# EAGLE design Adafruit 2.13in Tri-Color eInk FeatherWing (EAGLE 9.2.0)
COMPANY: ADAFRUIT INDUSTRIES; DRAWN: K. TOWNSEND; REV: A
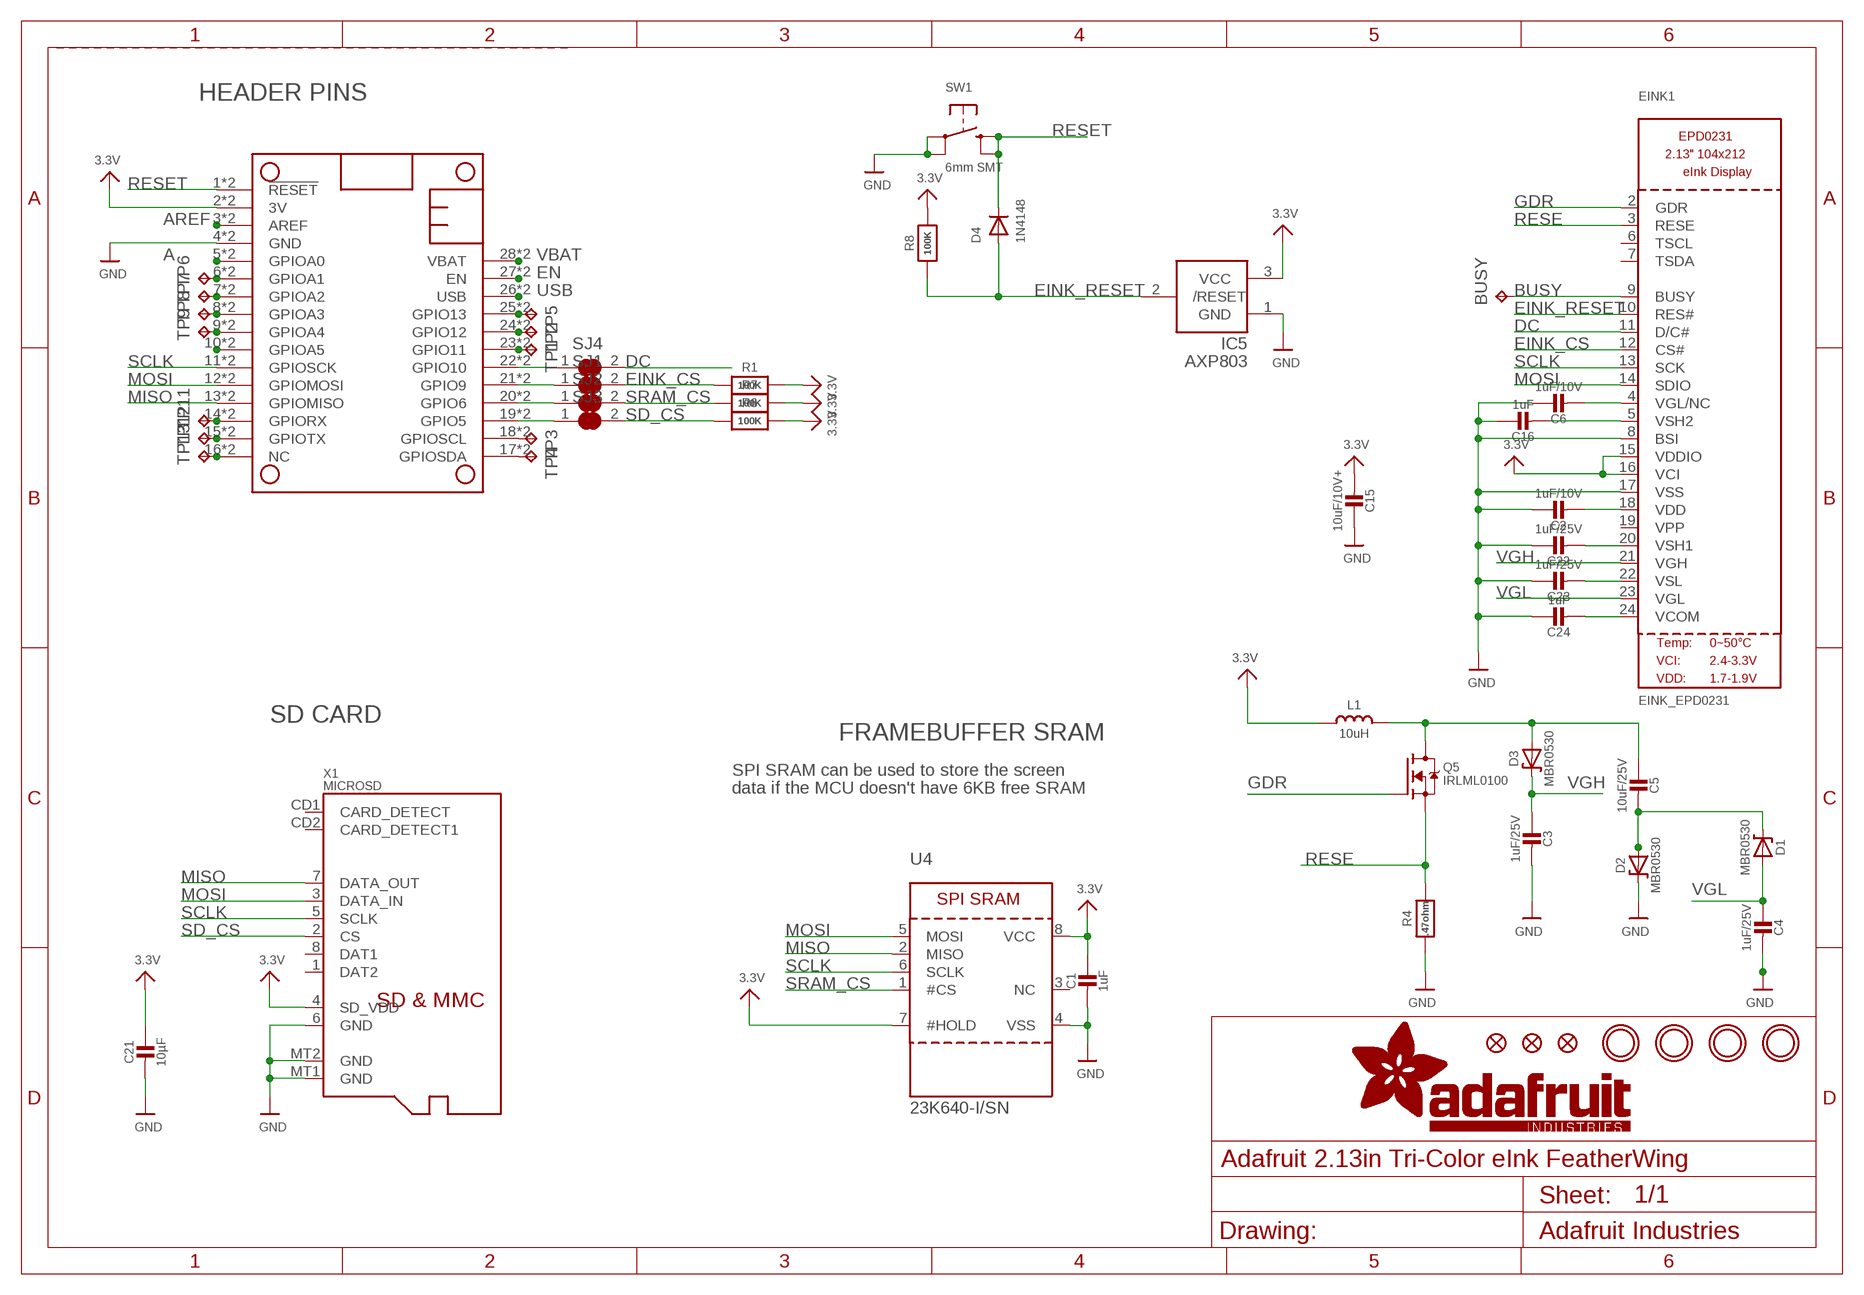
[diagram p0: schematic, sheet 1]

## Parts
BUSY  TPTP15SQ  [TP15SQ]
C1  1uF  CAP_CERAMIC0805_10MGAP  [0805_10MGAP]
C2  1uF/10V  CAP_CERAMIC0805-NOOUTLINE  [0805-NO]
C3  1uF/25V  CAP_CERAMIC0805-NOOUTLINE  [0805-NO]
C4  1uF/25V  CAP_CERAMIC0805-NOOUTLINE  [0805-NO]
C5  10uF/25V  CAP_CERAMIC0805-NOOUTLINE  [0805-NO]
C6  1uF/10V  CAP_CERAMIC0805-NOOUTLINE  [0805-NO]
C15  10uF/10V+  CAP_CERAMIC0805-NOOUTLINE  [0805-NO]
C16  1uF  CAP_CERAMIC0805-NOOUTLINE  [0805-NO]
C21  10µF  CAP_CERAMIC0805-NOOUTLINE  [0805-NO]
C22  1uF/25V  CAP_CERAMIC0805-NOOUTLINE  [0805-NO]
C23  1uF/25V  CAP_CERAMIC0805-NOOUTLINE  [0805-NO]
C24  1uF  CAP_CERAMIC0805-NOOUTLINE  [0805-NO]
D1  MBR0530  DIODE-SCHOTTKYSOD-123  [SOD-123]
D2  MBR0530  DIODE-SCHOTTKYSOD-123  [SOD-123]
D3  MBR0530  DIODE-SCHOTTKYSOD-123  [SOD-123]
D4  1N4148  DIODESOD-323F  [SOD-323F]
EINK1  EINK_EPD0231  [EINK_213IN_104X212]
FID1  FIDUCIAL_1MM  [FIDUCIAL_1MM]
FID2  FIDUCIAL_1MM  [FIDUCIAL_1MM]
FID3  FIDUCIAL_1MM  [FIDUCIAL_1MM]
IC5  AXP803  AXP083-SAG  [SOT23]
L1  10uH  INDUCTORNR401  [INDUCTOR_4X4MM_NR401]
MS1  FEATHERWING_SMTDUALNOHOLES  [FEATHERWING_SMT_NOHOLES]
Q5  IRLML0100  IRLML2060TRPBF  [SOT23-3]
R1  100K  RESISTOR_0603_NOOUT  [0603-NO]
R4  .47ohm  RESISTOR0805_10MGAP  [0805_10MGAP]
R6  100K  RESISTOR_0603_NOOUT  [0603-NO]
R7  100K  RESISTOR_0603_NOOUT  [0603-NO]
R8  100K  RESISTOR_0603_NOOUT  [0603-NO]
SJ1  SOLDERJUMPER_CLOSED  [SOLDERJUMPER_CLOSEDWIRE]
SJ2  SOLDERJUMPER_CLOSED  [SOLDERJUMPER_CLOSEDWIRE]
SJ3  SOLDERJUMPER_CLOSED  [SOLDERJUMPER_CLOSEDWIRE]
SJ4  SOLDERJUMPER_CLOSED  [SOLDERJUMPER_CLOSEDWIRE]
SW1  6mm SMT  SWITCH_TACT_SMT_EVQQ2_SMALL  [EVQ-Q2_SMALLER]
TP1  TPTP15SQ  [TP15SQ]
TP2  TPTP15SQ  [TP15SQ]
TP3  TPTP15SQ  [TP15SQ]
TP4  TPTP15SQ  [TP15SQ]
TP5  TPTP15SQ  [TP15SQ]
TP6  TPTP15SQ  [TP15SQ]
TP7  TPTP15SQ  [TP15SQ]
TP8  TPTP15SQ  [TP15SQ]
TP9  TPTP15SQ  [TP15SQ]
TP11  TPTP15SQ  [TP15SQ]
TP12  TPTP15SQ  [TP15SQ]
TP13  TPTP15SQ  [TP15SQ]
U4  23K640-I/SN  SRAM_SPI_SOIC8  [SOIC8_150MIL]
U$3  MOUNTINGHOLE2.5  [MOUNTINGHOLE_2.5_PLATED]
U$4  MOUNTINGHOLE2.5  [MOUNTINGHOLE_2.5_PLATED]
U$5  MOUNTINGHOLE2.5  [MOUNTINGHOLE_2.5_PLATED]
U$6  MOUNTINGHOLE2.5  [MOUNTINGHOLE_2.5_PLATED]
X1  MICROSD  [MICROSD]

## Nets
3.3V: C1.1 C15.2 C21.1 EINK1.15(VDDIO) EINK1.16(VCI) IC5.3(VCC) L1.P$2 MS1.2(3V) MS1.2B(3V) R1.2 R6.2 R7.2 R8.2 U4.7(#HOLD) U4.8(VCC) X1.4(SD_VDD)
A: MS1.5(GPIOA0) MS1.5B(GPIOA0)
AREF: MS1.3(AREF) MS1.3B(AREF)
B: MS1.6(GPIOA1) MS1.6B(GPIOA1) TP6.TP
BUSY: BUSY.TP EINK1.9(BUSY)
C: MS1.7(GPIOA2) MS1.7B(GPIOA2) TP7.TP
D: MS1.8(GPIOA3) MS1.8B(GPIOA3) TP8.TP
DC: EINK1.11(D/C#) SJ4.2
E: MS1.9(GPIOA4) MS1.9B(GPIOA4) TP9.TP
EINK_CS: EINK1.12(CS#) R1.1 SJ1.2
EINK_RESET: D4.A EINK1.10(RES#) IC5.2(/RESET) R8.1
EN: MS1.27(EN) MS1.27B(EN)
F: MS1.10(GPIOA5) MS1.10B(GPIOA5)
G: MS1.16(NC) MS1.16B(NC) TP13.TP
GDR: EINK1.2(GDR) Q5.1(G)
GND: C1.2 C2.1 C3.2 C4.2 C6.1 C15.1 C16.1 C21.2 C22.1 C23.1 C24.1 D2.C EINK1.8(BSI) EINK1.17(VSS) IC5.1(GND) MS1.4(GND) MS1.4B(GND) R4.2 SW1.A'(P1) SW1.A(P) U4.4(VSS) X1.6(GND) X1.MT1(GND) X1.MT2(GND)
H: MS1.19(GPIO5) MS1.19B(GPIO5) SJ3.1
I: MS1.20(GPIO6) MS1.20B(GPIO6) SJ2.1
J: MS1.21(GPIO9) MS1.21B(GPIO9) SJ1.1
K: MS1.22(GPIO10) MS1.22B(GPIO10) SJ4.1
L: MS1.23(GPIO11) MS1.23B(GPIO11) TP1.TP
M: MS1.24(GPIO12) MS1.24B(GPIO12) TP2.TP
MISO: MS1.13(GPIOMISO) MS1.13B(GPIOMISO) U4.2(MISO) X1.7(DATA_OUT)
MOSI: EINK1.14(SDIO) MS1.12(GPIOMOSI) MS1.12B(GPIOMOSI) U4.5(MOSI) X1.3(DATA_IN)
N: MS1.25(GPIO13) MS1.25B(GPIO13) TP5.TP
N$2: C5.2 D1.C D2.A
N$3: C5.1 D3.A L1.P$1 Q5.3(D)
N$4: C16.2 EINK1.5(VSH2)
N$5: C2.2 EINK1.18(VDD)
N$6: C22.2 EINK1.20(VSH1)
N$9: C6.2 EINK1.4(VGL/NC)
N$27: C23.2 EINK1.22(VSL)
N$33: C24.2 EINK1.24(VCOM)
RESE: EINK1.3(RESE) Q5.2(S) R4.1
RESET: D4.C MS1.1(!RESET) MS1.1B(!RESET) SW1.B'(S1) SW1.B(S)
RX: MS1.14(GPIORX) MS1.14B(GPIORX) TP11.TP
SCL: MS1.18(GPIOSCL) MS1.18B(GPIOSCL) TP3.TP
SCLK: EINK1.13(SCK) MS1.11(GPIOSCK) MS1.11B(GPIOSCK) U4.6(SCLK) X1.5(SCLK)
SD_CS: R6.1 SJ3.2 X1.2(CS)
SDA: MS1.17(GPIOSDA) MS1.17B(GPIOSDA) TP4.TP
SRAM_CS: R7.1 SJ2.2 U4.1(#CS)
TX: MS1.15(GPIOTX) MS1.15B(GPIOTX) TP12.TP
USB: MS1.26(USB) MS1.26B(USB)
VBAT: MS1.28(VBAT) MS1.28B(VBAT)
VGH: C3.1 D3.C EINK1.21(VGH)
VGL: C4.1 D1.A EINK1.23(VGL)
Unconnected: EINK1.6(TSCL) EINK1.7(TSDA) EINK1.19(VPP) U4.3(NC) X1.1(DAT2) X1.8(DAT1) X1.CD1(CARD_DETECT) X1.CD2(CARD_DETECT1)

## Notes on the sheet
- HEADER PINS
- SD CARD
- FRAMEBUFFER SRAM
- SPI SRAM can be used to store the screen
- data if the MCU doesn't have 6KB free SRAM

## Library data of the parts
BUSY TP1-TP9 TP11-TP13 = testpad:TP: Test pad
C1-C6 C15 C16 C21-C24 = microbuilder:CAP_CERAMIC: Ceramic Capacitors For new designs, use the packages preceded by an '_' character since they are more reliable: The following footprints should be used on most boards: _0402 - Standard footprint for regular board layouts _0603 - Standard footprint for regular board layouts _0805 - Standard footprint for regular board layouts _1206 - Standard footprint for regular board layouts For extremely tight-pitch boards where space is at a premium, the following 'micro-pitch' footprints can be used (smaller pads, no silkscreen outline, etc.): _0402MP - Micro-pitch footprint for very dense/compact boards _0603MP - Micro-pitch footprint for very dense/compact boards _0805MP - Micro-pitch footprint for very dense/compact boards _1206MP - Micro-pitch footprint for very dense/compact boards
D1-D3 = microbuilder:DIODE-SCHOTTKY
D4 = adafruit:DIODE: Diode SMADIODE - SMA Surface Mount Package 20V 1A Schottky Diode Digikey: 641-1014-6-ND DO-1N4148 - Through Hole Small Current Diode SOD-123 20V 1 A (.5mV Vf) Schottky Diode - Digikey: MBRX120TPMSCT-ND SOD-323 10V 570mA (.38mV Vf, 3ns) Schottky Diode - Digikey: ZLLS410CT-ND SOD-523 30V 30mA Schottky Diode (RB751S-40TE61) - Digikey: RB751S-40TE61CT-ND SOT23-R/W - SOT23 Package (R = Solder Paste/Reflow Ovens, W = Hand-Soldering) BAT54Film 40V 300mA - Digikey: 497-7162-1-ND
EINK1 = microbuilder:EINK_EPD0231
FID1-FID3 = microbuilder:FIDUCIAL: Fiducial Alignment Points Various fiducial points for machine vision alignment.; BOM: EXCLUDE
IC5 = adafruit:AXP083
L1 = microbuilder:INDUCTOR: Inductors 0603: 10nH Ceramic Inductor - microwire antenna/RF (Digikey: 712-1434-2-ND) 0805: 560nH Ceramic Inductor - RF (Digikey: 553-1047-1-ND) 270nH Ceramic Inductor - Q = 40@250MHz, +-5%, 1 Ohm DC Resistance (Digikey: 535-10506-2-ND) 1007 (2518 Metric) SMT: 10µH 10% 250mOhm 820mA 1007 Inductor (Digikey: 587-2189-1-ND) 22µH 10% 500mOhm 580mA 1007 Inductor (Digikey: 587-2190-1-ND) 47µH 10% 950mOhm 420mA 1007 Inductor (Digikey: 587-2191-1-ND) 47µH 5% 100mOhm 1A 1008 Inductor (Digikey: 732-1816-1-ND) 5.0x5.0mm (Taiyo Yuden NR5040 Series) 6.8µH 20% 2.3A 64mOhm Inductor (Digikey: 587-2374-2-ND) 5.0x5.0mm (TDK VLC5045 Series) 4.7µH 20% 3.3A 34mOhm Inductor (Digikey: 445-6526-1-ND) 6.8µH 20% 2.7A 46mOhm Inductor (Digikey: 445-6527-1-ND) 6.0x6.0mm (TDK VLC6045 Series) 4.7µH 20% 3.8A 27mOhm Inductor (Digikey: 445-6538-2-ND) 6.8µH 20% 3A 41mOhm Inductor (Digikey: 445-6540-1-ND) 6.2µH 30% 2.2A 45mOhm Inductor (Digikey: SRR5028-6R2YCT-ND) - Not TDK VLC6045 but footprint should match 6.0x6.0mm (TDK SLF6045 Series) 6.8uH 30% 2A 33mOhm Inductor (Digikey: 445-4572-1-ND, Mouser: 810-SLF645T6R8N2R0PF) 6.0x6.0mm (Sumida CDRH5D28 Series) 6.2uH 30% 1.8A 45mOhm Inductor (Digikey: 308-1542-1-ND) Taiyo Yuden NR3015T2R2M - 2.2uH 20% 1.5A (Digikey: 587-1648-2-ND, Mouser: 963-NR3015T2R2M) - Used with TI TPS62172 CoilCraft RFID Transponder Coil - MA5532-AE (For use with AS3935 Lightning Sensor) Taiyo Yuden NRH2412T2R2MNGH - 2.2uH 20% 1AA (Digikey: 587-3443-1-ND) - Used with TI LM3671 Vishay IHLP 1.0uH Molded Inductor - 24mOhm DCR, 5A, +/-20%, -55°C-125°C (Digikey: 541-1319-1-ND)
MS1 = microbuilder:FEATHERWING
Q5 = Parts:IRLML2060TRPBF
R1 R4 R6-R8 = microbuilder:RESISTOR: Resistors For new designs, use the packages preceded by an '_' character since they are more reliable: The following footprints should be used on most boards: _0402 - Standard footprint for regular board layouts _0603 - Standard footprint for regular board layouts _0805 - Standard footprint for regular board layouts _1206 - Standard footprint for regular board layouts For extremely tight-pitch boards where space is at a premium, the following 'micro-pitch' footprints can be used (smaller pads, no silkscreen outline, etc.): _0402MP - Micro-pitch footprint for very dense/compact boards _0603MP - Micro-pitch footprint for very dense/compact boards _0805MP - Micro-pitch footprint for very dense/compact boards _1206MP - Micro-pitch footprint for very dense/compact boards
SJ1-SJ4 = microbuilder:SOLDERJUMPER_CLOSED: Solder Jumper - Closed These solder jumpers are closed by default CLOSEDWIRE - 10 mil trace between pads that can be cut and resoldered later CLOSEDPERM - 63 mil trace between pads for a permanent connection (used to 'bridge' two signals, a shameless hack for Eagle). Can double as a test point as well (no cream layer)
SW1 = microbuilder:SWITCH_TACT_SMT: SMT Tact Switches 6x6mm - Digikey: P12940SCT-ND KMR2 (4.6x2.8mm) - Digikey: 401-1426-1-ND EVQ-PQHB55 - Light Touch, 160GF (4.5x4.5mm) - Digikey: P8090SCT-ND KMT0 - KMT021 NGJ LHS (etc.) IP68/Waterproof - Digikey: CKN10289CT-ND
U4 = microbuilder:SRAM_SPI_SOIC8: SRAM - 8-Pin SPI Interface 23K640-I/SN - 8KB (64Kb), 20MHz, 2.7-3.6V 23K256-I/SN - 32KB (256Kb), 20MHz, 2.7-3.6V 23LC512-I/SN - 64KB (512Kb), 20MHz, 2.7-3.6V
U$3-U$6 = microbuilder:MOUNTINGHOLE: Mounting Hole For #2 screws (0.086"/2.18mm width, 0.094"/2.4mm hole) use 2.5mm; BOM: EXCLUDE
X1 = microbuilder:MICROSD: MicroSD/Transflash Card Holder with SPI pinout 3M: 2908-05WB-MG 4UConnector: 19656 Footprint courtesy: Adafruit Industries

## Board
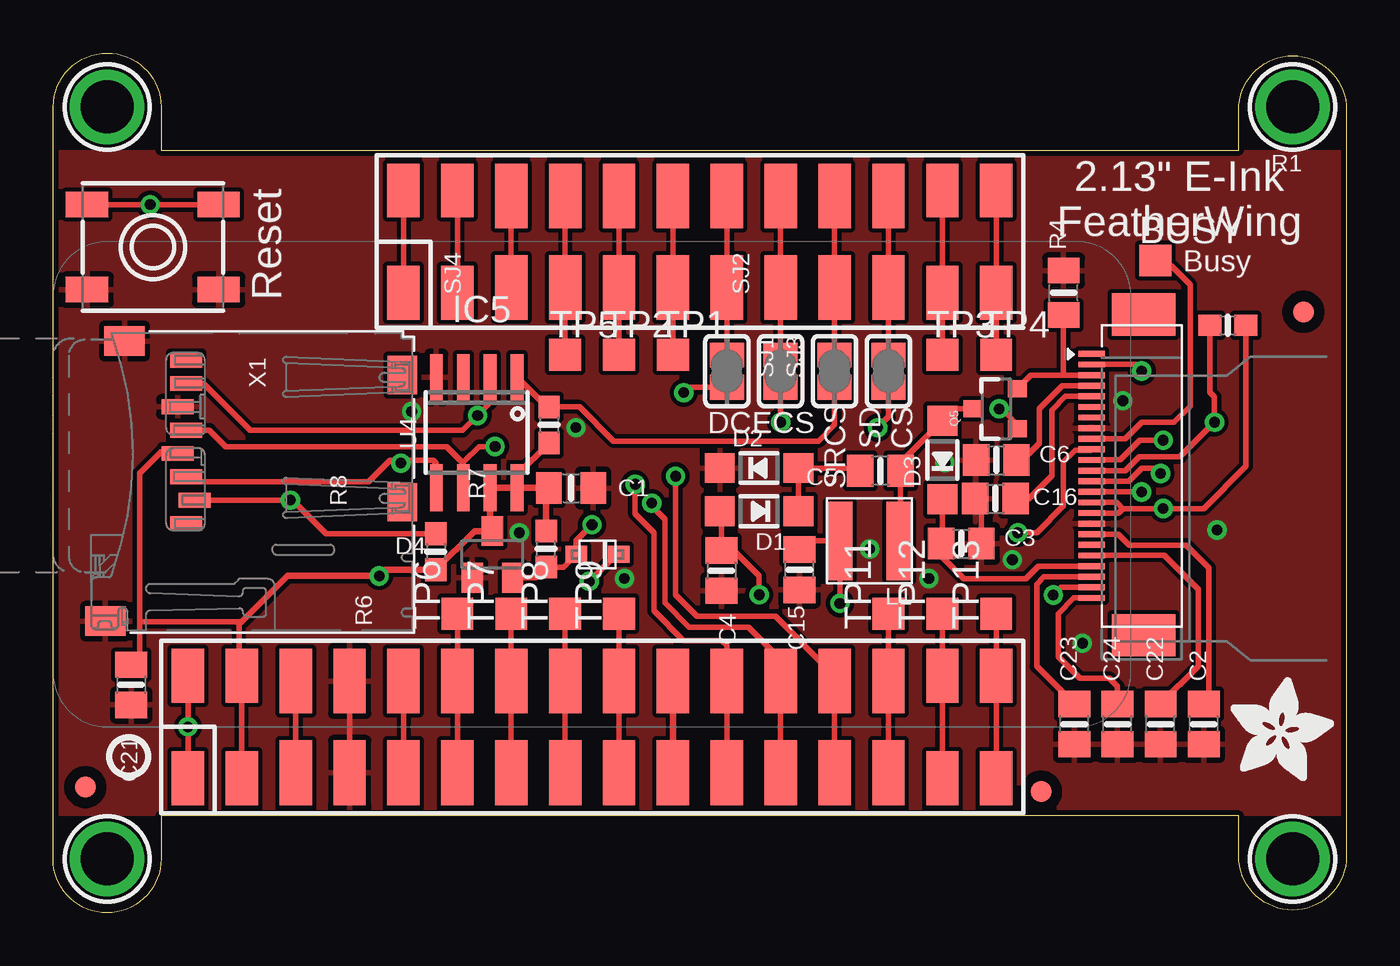
[diagram p1: board, top side]
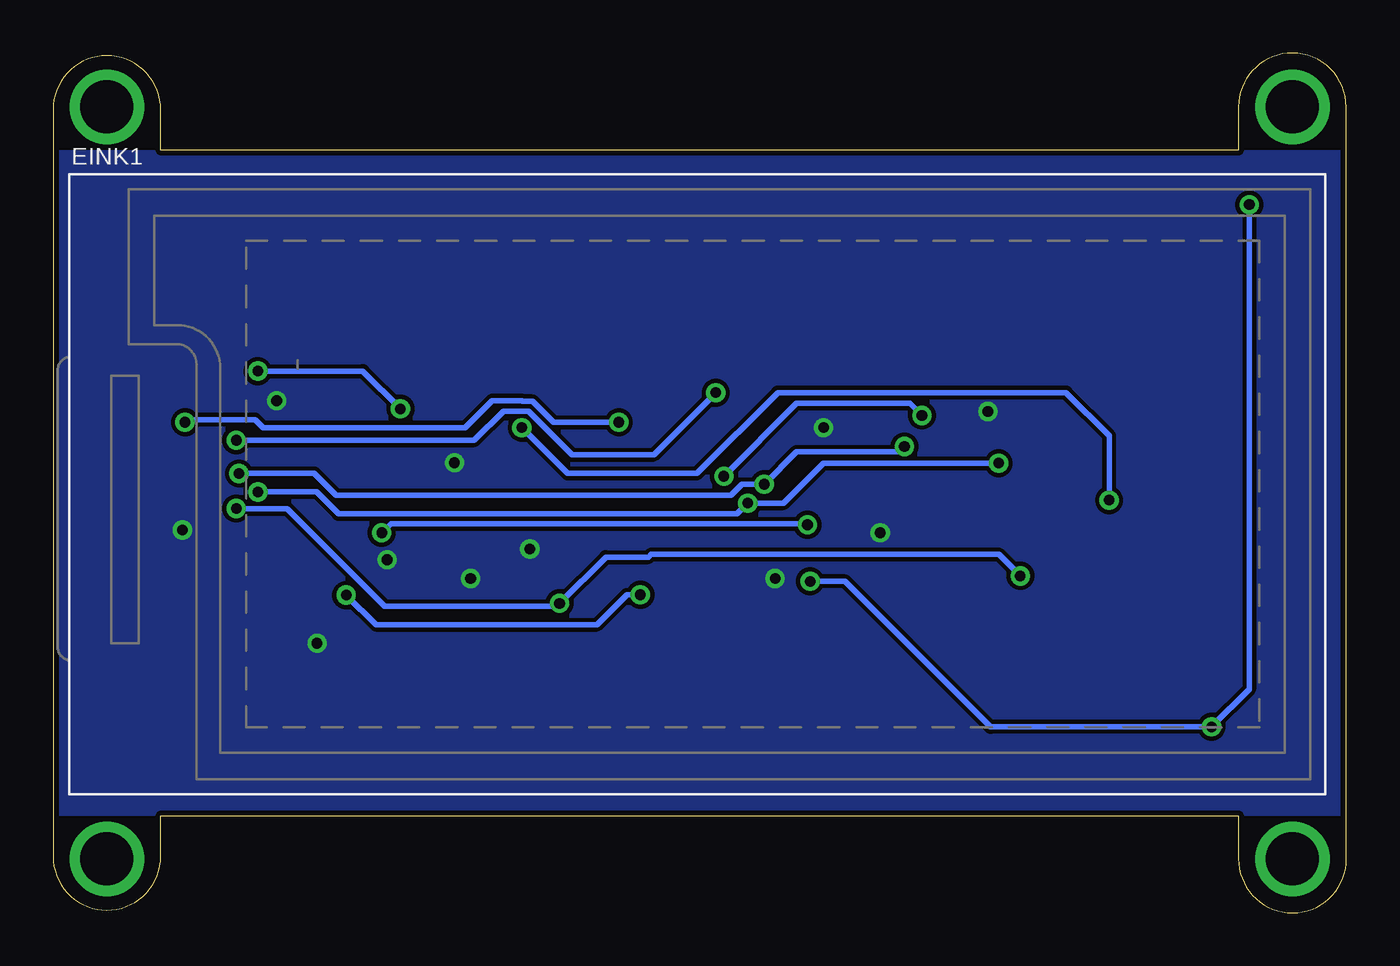
[diagram p2: board, bottom side, seen from below]

Size 60.97 x 40.51 mm. Coordinates in mm from the lower left corner, seen from the top.
Outline: 58.43,0.13 arc-90 55.89,2.67 55.89,4.57 5.09,4.57 5.09,2.54 arc-90 2.55,0 2.54,0 arc-90 0,2.54 0.01,37.97 arc-90 2.55,40.51 2.55,40.51 arc-90 5.09,37.97 5.09,35.94 55.89,35.94 55.89,37.85 arc-90 58.43,40.39 arc-90 60.97,37.85 60.97,2.67 arc-90 58.43,0.13
Copper layers (1*16): Top 0.035mm / dielectric 1.5mm / Bottom 0.035mm
Design rules "adafruit *": minimum track width 8mil, minimum drill 15.5mil, track to track 8mil, track to pad 8mil, pad to pad 8mil, via to via 8mil, smd to smd 8mil, copper to edge 10mil, drill to drill 8mil, minimum pad ring 10mil, minimum via ring 8mil, stop-mask expansion 2mil, vias tented up to drill 20mil, thermal gap 10mil

### Footprints (pad centres in the part's own frame; a part is rotated, then mirrored left to right if it is on the bottom)
TP15SQ = smd 1.5 x 1.5: TP 0,0
0805_10MGAP = smd 1.2 x 1.5: 1 -1.05,0; 2 1.05,0
0805-NO = smd 1.24 x 1.5: 1 -0.95,0; 2 0.95,0
SOD-123 = smd 1.4 x 1.4: A 1.85,0; C -1.85,0
SOD-323F = smd 1 x 0.8: A -1,0; C 1,0
EINK_213IN_104X212 = smd 1.25 x 0.275 bottom: 1 11.26,-8.46; 2 11.26,-8.96; 3 11.26,-9.46; 4 11.26,-9.96; 5 11.26,-10.46; 6 11.26,-10.96; 7 11.26,-11.46; 8 11.26,-11.96; 9 11.26,-12.46; 10 11.26,-12.96; 11 11.26,-13.46; 12 11.26,-13.96; 13 11.26,-14.46; 14 11.26,-14.96; 15 11.26,-15.46; 16 11.26,-15.96; 17 11.26,-16.46; 18 11.26,-16.96; 19 11.26,-17.46; 20 11.26,-17.96; 21 11.26,-18.46; 22 11.26,-18.96; 23 11.26,-19.46; 24 11.26,-19.96 | smd 3 x 2 bottom: SPRT1 8.8,-6.61; SPRT2 8.8,-21.72
FIDUCIAL_1MM = smd 1 x 1: 1 0,0
SOT23 = smd 1 x 1.4: 1 -0.95,-1.1; 2 0.95,-1.1; 3 0,1.1
INDUCTOR_4X4MM_NR401 = smd 1.2 x 3.7: P$1 -1.4,0; P$2 1.4,0
FEATHERWING_SMT_NOHOLES = smd 1.524 x 2.54: 1 6.35,2.413; 1B 6.35,-2.413; 2 8.89,2.413; 2B 8.89,-2.413; 15 41.91,2.413; 15B 41.91,-2.413; 16 44.45,2.413; 16B 44.45,-2.413; 17 44.45,20.447; 17B 44.45,25.273; 18 41.91,20.447; 18B 41.91,25.273; 27 19.05,20.447; 27B 19.05,25.273; 28 16.51,20.447; 28B 16.51,25.273 | smd 1.524 x 3.048: 3 11.43,2.159; 3B 11.43,-2.159; 4 13.97,2.159; 4B 13.97,-2.159; 5 16.51,2.159; 5B 16.51,-2.159; 6 19.05,2.159; 6B 19.05,-2.159; 7 21.59,2.159; 7B 21.59,-2.159; 8 24.13,2.159; 8B 24.13,-2.159; 9 26.67,2.159; 9B 26.67,-2.159; 10 29.21,2.159; 10B 29.21,-2.159; 11 31.75,2.159; 11B 31.75,-2.159; 12 34.29,2.159; 12B 34.29,-2.159; 13 36.83,2.159; 13B 36.83,-2.159; 14 39.37,2.159; 14B 39.37,-2.159; 19 39.37,20.701; 19B 39.37,25.019; 20 36.83,20.701; 20B 36.83,25.019; 21 34.29,20.701; 21B 34.29,25.019; 22 31.75,20.701; 22B 31.75,25.019; 23 29.21,20.701; 23B 29.21,25.019; 24 26.67,20.701; 24B 26.67,25.019; 25 24.13,20.701; 25B 24.13,25.019; 26 21.59,20.701; 26B 21.59,25.019
SOT23-3 = smd 0.8 x 0.9: 1 -0.95,-1; 2 0.95,-1; 3 0,1.1
0603-NO = smd 1.075 x 1: 1 -0.85,0; 2 0.85,0
SOLDERJUMPER_CLOSEDWIRE = smd 1.168 x 1.6: 1 -0.762,0; 2 0.762,0 | smd 0.635 x 0.203: WIRE 0,0
EVQ-Q2_SMALLER = smd 2 x 1.2: A -3.1,-2; A' 3.1,-2; B -3.1,2; B' 3.1,2
SOIC8_150MIL = smd 0.6 x 2.2: 1 -1.905,-2.6; 2 -0.635,-2.6; 3 0.635,-2.6; 4 1.905,-2.6; 5 1.905,2.6; 6 0.635,2.6; 7 -0.635,2.6; 8 -1.905,2.6
MOUNTINGHOLE_2.5_PLATED = drill 2.5 pad 3.2: P$1 0,0
MICROSD = smd 0.7 x 1.5: 1 9,-10.64; 2 7.9,-10.24; 3 6.8,-10.64; 4 5.7,-11.04; 5 4.6,-10.64; 6 3.5,-11.04; 7 2.4,-10.64; 8 1.3,-10.64 | smd 1.8 x 1.4: CD1 2,-0.44; CD2 8,-0.44 | smd 1.4 x 1.9: MT1 0.4,-13.54; MT2 13.6,-14.44

### Placement (x,y rotation side)
BUSY  51.95,30.73 0 top
C1  24.41,20.01 0 top
C2  54.24,8.89 90 top
C3  42.81,17.4 0 top
C4  31.51,16.13 270 top
C5  39,20.83 180 top
C6  44.46,21.34 0 top
C15  35.19,16.17 90 top
C16  44.42,19.52 0 top
C21  3.68,10.74 270 top
C22  52.21,8.89 90 top
C23  48.14,8.89 90 top
C24  50.18,8.89 90 top
D1  33.28,18.92 180 top
D2  33.28,20.96 0 top
D3  41.92,21.34 90 top
D4  25.66,16.89 0 top
EINK1  60.21,34.8 0 bottom
FID1  46.57,5.71 0 top
FID2  1.52,5.92 90 top
FID3  58.94,28.32 0 top
IC5  20.71,16.89 0 top
L1  38.49,17.53 180 top
MS1  0.01,8.76 0 top
Q5  44.46,23.75 90 top
R1  55.38,27.69 0 top
R4  47.64,29.21 90 top
R6  18.04,17.02 270 top
R7  23.38,22.99 270 top
R8  23.25,17.14 90 top
SJ1  34.3,25.53 270 top
SJ2  36.84,25.53 270 top
SJ3  39.38,25.53 270 top
SJ4  31.76,25.53 270 top
SW1  4.71,31.37 0 top
TP1  29.22,26.29 0 top
TP2  26.68,26.29 0 top
TP3  41.92,26.29 0 top
TP4  44.46,26.29 0 top
TP5  24.14,26.29 0 top
TP6  19.06,14.1 90 top
TP7  21.6,14.1 90 top
TP8  24.14,14.1 90 top
TP9  26.68,14.1 90 top
TP11  39.38,14.1 90 top
TP12  41.92,14.1 90 top
TP13  44.46,14.1 90 top
U4  19.97,22.63 180 top
U$3  58.43,2.54 0 top
U$4  2.55,2.54 0 top
U$5  58.43,37.97 0 top
U$6  2.55,37.97 0 top
U$8  [ADAFRUIT_5MM]  55.51,6.22 0 top
U$9  [PCBFEAT-REV-040]  3.57,7.37 0 top
X1  16.91,27.34 270 top

### Tracks (layer width: path | path; a pad name or v marks a point on that pad's centre or on a via)
3.3V  (via drill 0.5)
  Top 0.254: MS1.2B MS1.2 8.77,11.3 8.77,13.59 8.65,13.72 | R7.2 21.88,20.63 U4.8 | C21.1 4.07,12.08 4.07,13.72 | X1.4 5.16,21.64 5.09,21.72 4.07,20.7 4.07,13.72 | 8.65,13.72 4.07,13.72 | 8.9,13.72 8.65,13.72 | EINK1.16 50.22,18.84 50.43,19.05 | 50.43,19.05 50.14,19.34 EINK1.15 | C15.2 35.59,17.53 L1.P$2 37.09,14.86 v37.09,14.58 | 50.43,19.05 v52.33,19.05 54.24,19.05 56.23,21.04 R1.2
  Top 0.305: 23.35,20.03 U4.8 U4.7 20.61,18.1 IC5.3 19.87,17.99 R6.2 15.67,16.17 v15.38,15.88 11.06,15.88 8.9,13.72 | 23.35,20.03 C1.1 | R8.2 23.25,19.93 23.35,20.03
  Bottom 0.254: v52.33,19.05 49.94,19.05 45.35,14.46 37.22,14.46 v37.09,14.58 34.91,16.76 32.9,16.76 32.78,16.89 16.39,16.89 v15.38,15.88
A
  Top 0.254: MS1.5 MS1.5B
AREF
  Top 0.254: MS1.3 MS1.3B
B
  Top 0.254: MS1.6B MS1.6 TP6.TP
BUSY
  Top 0.254: EINK1.9 50.54,22.34 51.32,23.11 52.84,23.11 53.6,23.88 53.6,29.59 52.72,30.48 52.21,30.48 BUSY.TP
C
  Top 0.254: MS1.7B MS1.7 TP7.TP
D
  Top 0.254: MS1.8B 24.14,10.67 MS1.8 TP8.TP
DC  (via drill 0.5)
  Top 0.254: EINK1.11 50.3,21.34 51.23,22.27 v52.33,22.27 | v29.73,24.51 29.98,24.77 SJ4.2
  Bottom 0.254: v52.33,22.27 41.12,22.27 39.74,23.64 38.55,23.64 36.49,21.59 32.65,21.59 v29.73,24.51
E
  Top 0.254: MS1.9B MS1.9 TP9.TP
EINK_CS  (via drill 0.5)
  Top 0.254: EINK1.12 50.55,20.84 51.2,21.48 53.12,21.48 v54.75,23.11 54.75,24.31 54.53,24.52 R1.1 | SJ1.2 v34.3,23.11
  Bottom 0.254: v34.3,23.11 37.37,23.11 38.36,24.1 38.84,24.1 38.87,24.13 40.27,24.13 41.54,22.86 51.06,22.86 51.45,23.24 54.62,23.24 v54.75,23.11
EINK_RESET  (via drill 0.5)
  Top 0.254: EINK1.10 48.92,21.81 48.19,21.81 47.64,21.25 47.64,19.18 46.37,17.91 v45.48,17.91 | IC5.2 22.75,15.79 R8.1 24.07,16.29 D4.A 24.66,17.54 v25.41,18.29
  Bottom 0.254: v45.48,17.91 45.04,18.34 25.46,18.34 v25.41,18.29
EN
  Top 0.254: MS1.27 MS1.27B
F
  Top 0.305: MS1.10 MS1.10B
G
  Top 0.254: MS1.16B MS1.16 TP13.TP
GDR  (via drill 0.5)
  Top 0.254: EINK1.2 51.01,25.84 v51.32,25.53 | v44.59,23.75 44.72,23.75 45.46,23.01 Q5.1
  Bottom 0.254: v51.32,25.53 46.37,25.53 v44.59,23.75
GND  (via drill 0.5)
  Top 0.254: MS1.4B MS1.4 | C3.2 43.76,19.23 C16.1
  other vias: 16.9,23.62 24.65,22.86 50.43,24.13 54.87,18.03 48.52,12.7 41.29,15.75 45.22,16.64 26.93,15.75 21.98,17.91 38.49,17.14 42.05,21.21
  pour Top: 0.14,35.81 60.97,35.81 60.97,4.7 0.14,4.7
  pour Bottom: 0.14,35.81 60.97,35.81 60.97,4.7 0.14,4.7
H
  Top 0.254: MS1.19B MS1.19 SJ3.1
I
  Top 0.254: MS1.20B MS1.20 SJ2.1
J
  Top 0.254: MS1.21B MS1.21 SJ1.1
K
  Top 0.254: MS1.22B MS1.22 SJ4.1
L
  Top 0.254: MS1.23B MS1.23 TP1.TP
M
  Top 0.254: MS1.24B MS1.24 TP2.TP
MISO  (via drill 0.5)
  Top 0.254: MS1.13B MS1.13 36.84,11.18 34.05,13.97 30.36,13.97 29.35,14.99 v29.35,20.57 | X1.7 7.07,24.94 9.28,22.73 19.31,22.73 v20.01,23.43 20.61,24.02 U4.2
  Bottom 0.254: v29.35,20.57 25.92,24 20.58,24 v20.01,23.43
MOSI  (via drill 0.5)
  Top 0.254: MS1.12B MS1.12 34.3,11.94 32.78,13.46 29.98,13.46 28.84,14.61 28.84,18.54 28.23,19.16 v28.23,19.3 | U4.5 18.07,21.19 17.92,21.34 16.52,21.34 | 16.52,21.34 15.89,21.34 14.87,20.32 6.49,20.32 X1.3 | v16.39,21.19 16.52,21.32 16.52,21.34 | EINK1.14 v51.31,19.84 v51.32,19.83
  Bottom 0.254: v16.39,21.19 24.65,21.19 26.53,19.3 v28.23,19.3 28.73,18.8 47.51,18.8 48.55,19.83 v51.32,19.83
N
  Top 0.254: MS1.25B MS1.25 TP5.TP
N$2
  Top 0.254: D1.C D2.A 37.92,20.96 C5.2
N$3
  Top 0.254: Q5.3 42.48,23.75 D3.A 39.95,21.21 C5.1 39.95,17.58 L1.P$1
N$4
  Top 0.254: EINK1.5 47.73,24.34 47.08,23.69 47.08,20.59 46.01,19.52 C16.2
N$5
  Top 0.254: EINK1.18 50.22,17.84 50.73,17.33 53.42,17.33 54.49,16.26 54.49,10.09 C2.2
N$6
  Top 0.254: C22.2 53.99,11.62 53.99,15.24 52.39,16.84 EINK1.20
N$9
  Top 0.254: EINK1.4 47.58,24.84 46.49,23.75 46.49,22.14 45.7,21.34 C6.2
N$27
  Top 0.254: EINK1.22 46.71,15.84 46.37,15.49 46.37,11.62 C23.2
N$33
  Top 0.254: EINK1.24 48.12,14.84 47.38,14.1 47.38,12.06 48.4,11.05 49.79,11.05 50.18,10.67 C24.2
RESE
  Top 0.254: EINK1.3 47.64,25.34 | 47.64,25.34 46.1,25.34 Q5.2 | R4.1 47.64,25.34
RESET  (via drill 0.5)
  Top 0.254: MS1.1 v6.36,8.76 MS1.1B | SW1.B' v4.58,33.37 SW1.B | v25.28,15.62 26.55,16.89 D4.C
  Bottom 0.254: v4.58,33.37 4.58,10.54 v6.36,8.76 16.77,8.76 23.63,15.62 v25.28,15.62
RX
  Top 0.254: MS1.14B 39.38,10.79 MS1.14 TP11.TP
SCL
  Top 0.254: MS1.18B MS1.18 TP3.TP
SCLK  (via drill 0.5)
  Top 0.254: MS1.11B MS1.11 31.76,12.57 31.51,12.83 29.73,12.83 28.33,14.22 28.33,17.91 27.44,18.8 v27.44,20.19 | X1.5 7.37,22.74 8.14,21.97 18.55,21.97 19.34,21.19 | 19.34,21.19 U4.6 | 19.34,21.19 19.34,21.23 20.08,21.97 v20.84,21.97 | EINK1.13 50.7,20.34 51.32,20.96 51.95,20.96 v52.21,20.7
  Bottom 0.254: v20.84,21.97 21.09,21.72 25.92,21.72 v27.44,20.19 28.49,20.19 29,19.68 47.64,19.68 48.65,20.7 v52.21,20.7
SD_CS  (via drill 0.5)
  Top 0.254: X1.2 v11.19,19.44 11.3,19.44 12.88,17.87 R6.1 | v38.87,22.86 39.38,23.37 SJ3.2
  Bottom 0.254: v11.19,19.44 11.19,22.48 13.22,24.51 26.81,24.51 30.62,20.7 36.71,20.7 v38.87,22.86
SDA
  Top 0.254: MS1.17B MS1.17 TP4.TP
SRAM_CS
  Top 0.254: U4.1 23.26,23.84 R7.1 24.81,23.84 26.43,22.23 36.08,22.23 36.84,22.99 SJ2.2
TX
  Top 0.254: MS1.15B MS1.15 TP12.TP
USB
  Top 0.254: MS1.26B MS1.26
VBAT
  Top 0.254: MS1.28B MS1.28
VGH
  Top 0.254: D3.C 41.92,17.46 | 41.92,17.46 C3.1 | EINK1.21 46.45,16.34 45.86,15.75 42.94,15.75 41.92,16.76 41.92,17.46
VGL  (via drill 0.5)
  Top 0.254: D1.A 31.51,18.85 C4.1 32.08,17.08 33.28,15.88 v33.28,14.99 | EINK1.23 47.51,15.34 v47.15,14.97
  Bottom 0.254: v47.15,14.97 45.75,13.58 35.33,13.58 33.92,14.99 v33.28,14.99

### Text on the board
tPlace: 2.13" E-Ink / FeatherWing | Reset | Busy | DC | ECS | SRCS | SD / CS